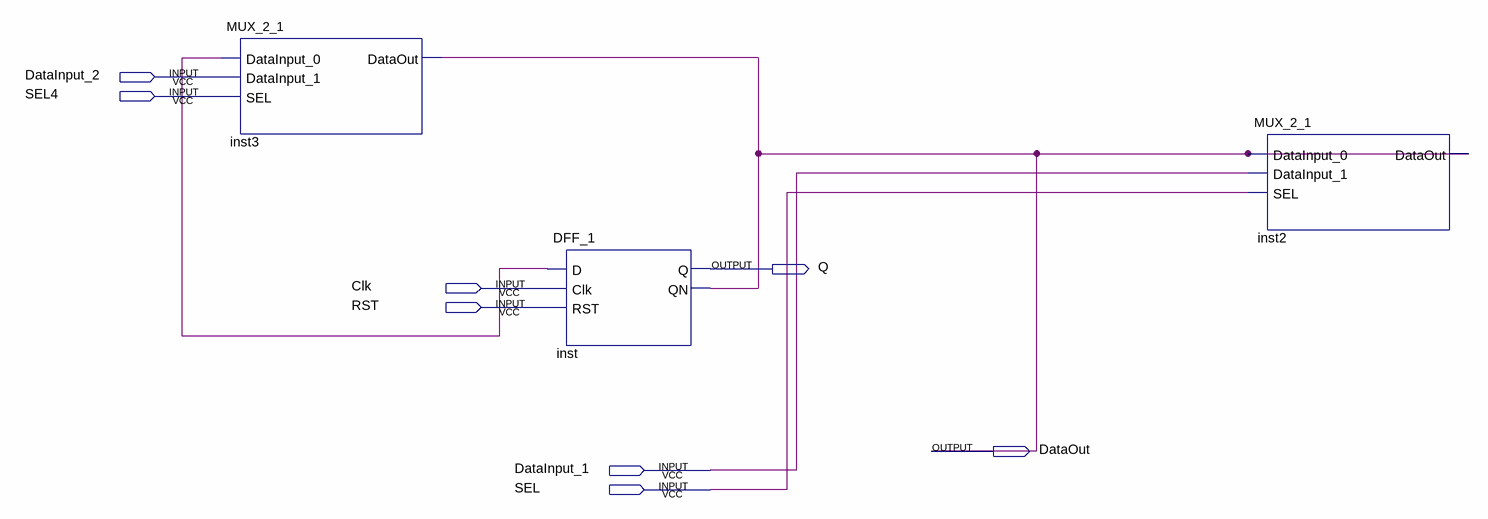
[diagram p0: schematic sheet]
// Quartus schematic test.bdf as structural Verilog: 3 symbols, 8 pins
module test (
  input  DataInput_2,
  input  SEL4,
  input  Clk,
  input  RST,
  input  DataInput_1,
  input  SEL,
  output Q,
  output DataOut
);

  wire undriven;

  MUX_2_1 inst3 (.DataInput_0(undriven), .DataInput_1(DataInput_2), .SEL(SEL4), .DataOut(DataOut));
  DFF_1 inst (.D(undriven), .Clk(Clk), .RST(RST), .Q(Q), .QN(DataOut));
  MUX_2_1 inst2 (.DataInput_0(DataOut), .DataInput_1(DataInput_1), .SEL(SEL), .DataOut(DataOut));
endmodule
